# EAGLE design FF0881SA1 (EAGLE 9.6.2)
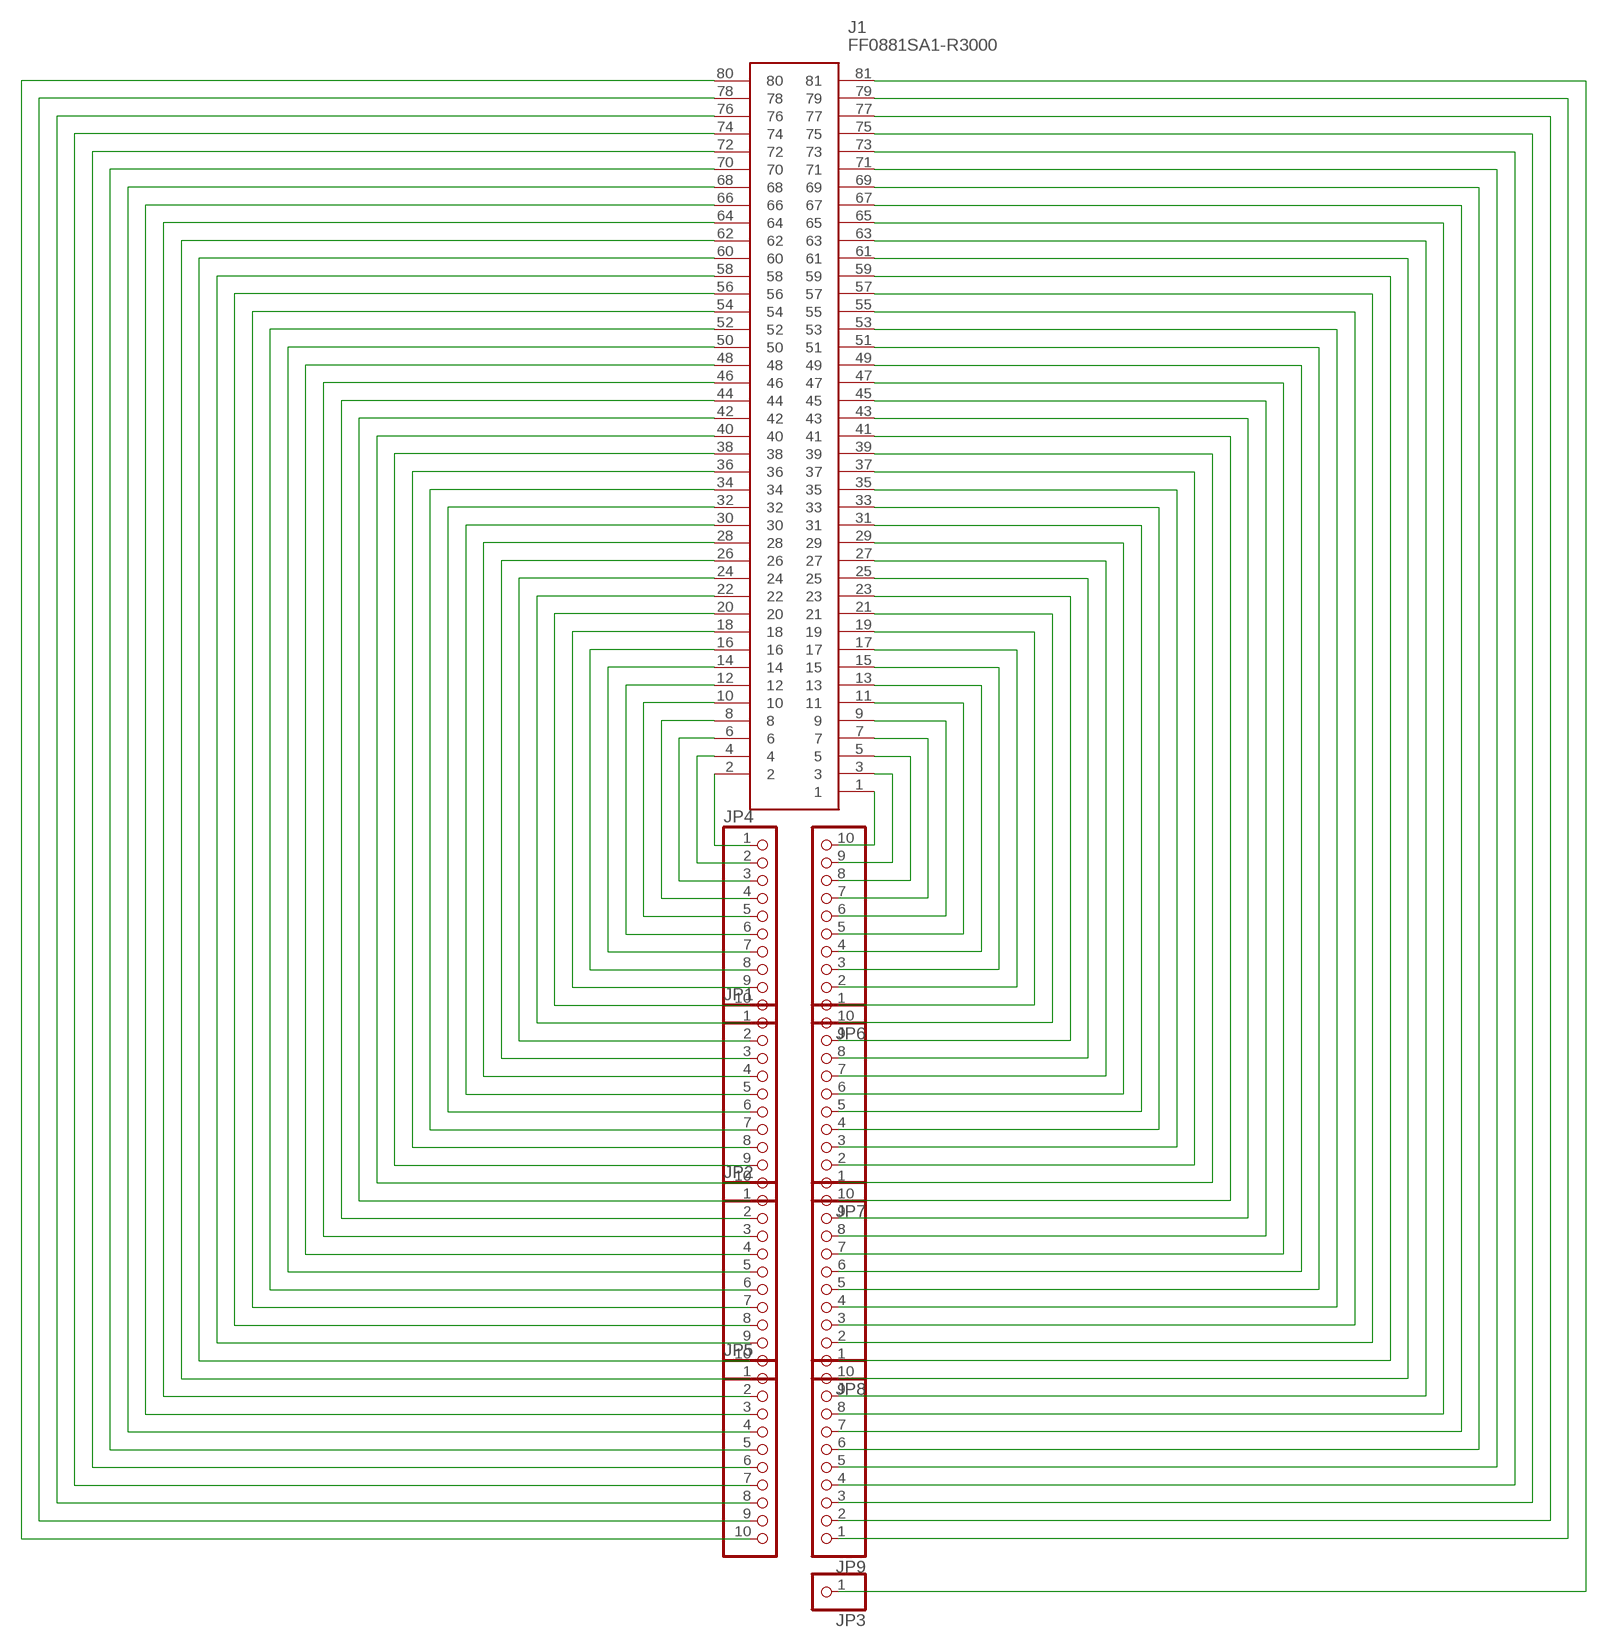
[diagram p0: schematic, sheet 1]

## Parts
J1  FF0881SA1-R3000  [FF0881SA1R3000]
JP1  PINHD-1X10  [1X10]
JP2  PINHD-1X10  [1X10]
JP3  PINHD-1X1  [1X01]
JP4  PINHD-1X10  [1X10]
JP5  PINHD-1X10  [1X10]
JP6  PINHD-1X10  [1X10]
JP7  PINHD-1X10  [1X10]
JP8  PINHD-1X10  [1X10]
JP9  PINHD-1X10  [1X10]

## Nets
N$1: J1.1 JP6.10
N$2: J1.3 JP6.9
N$3: J1.5 JP6.8
N$4: J1.7 JP6.7
N$5: J1.9 JP6.6
N$6: J1.11 JP6.5
N$7: J1.13 JP6.4
N$8: J1.15 JP6.3
N$9: J1.17 JP6.2
N$10: J1.19 JP6.1
N$11: J1.21 JP7.10
N$12: J1.23 JP7.9
N$13: J1.2 JP4.1
N$14: J1.4 JP4.2
N$15: J1.6 JP4.3
N$16: J1.8 JP4.4
N$17: J1.10 JP4.5
N$18: J1.12 JP4.6
N$19: J1.14 JP4.7
N$20: J1.16 JP4.8
N$21: J1.18 JP4.9
N$22: J1.20 JP4.10
N$23: J1.22 JP1.1
N$24: J1.24 JP1.2
N$25: J1.26 JP1.3
N$26: J1.28 JP1.4
N$27: J1.30 JP1.5
N$28: J1.32 JP1.6
N$29: J1.34 JP1.7
N$30: J1.36 JP1.8
N$31: J1.38 JP1.9
N$32: J1.40 JP1.10
N$33: J1.42 JP2.1
N$34: J1.44 JP2.2
N$35: J1.25 JP7.8
N$36: J1.27 JP7.7
N$37: J1.29 JP7.6
N$38: J1.31 JP7.5
N$39: J1.33 JP7.4
N$40: J1.35 JP7.3
N$41: J1.37 JP7.2
N$42: J1.39 JP7.1
N$43: J1.41 JP8.10
N$44: J1.43 JP8.9
N$45: J1.46 JP2.3
N$46: J1.48 JP2.4
N$47: J1.50 JP2.5
N$48: J1.52 JP2.6
N$49: J1.54 JP2.7
N$50: J1.56 JP2.8
N$51: J1.58 JP2.9
N$52: J1.60 JP2.10
N$53: J1.62 JP5.1
N$54: J1.64 JP5.2
N$55: J1.66 JP5.3
N$56: J1.68 JP5.4
N$57: J1.70 JP5.5
N$58: J1.72 JP5.6
N$59: J1.74 JP5.7
N$60: J1.76 JP5.8
N$61: J1.78 JP5.9
N$62: J1.80 JP5.10
N$63: J1.45 JP8.8
N$64: J1.47 JP8.7
N$65: J1.49 JP8.6
N$66: J1.51 JP8.5
N$67: J1.53 JP8.4
N$68: J1.55 JP8.3
N$69: J1.57 JP8.2
N$70: J1.59 JP8.1
N$71: J1.61 JP9.10
N$72: J1.63 JP9.9
N$73: J1.65 JP9.8
N$74: J1.67 JP9.7
N$75: J1.69 JP9.6
N$76: J1.71 JP9.5
N$77: J1.73 JP9.4
N$78: J1.75 JP9.3
N$79: J1.77 JP9.2
N$80: J1.79 JP9.1
N$81: J1.81 JP3.1

## Library data of the parts
J1 = SamacSys_Parts:FF0881SA1-R3000: FFC & FPC Connectors 81P 0.2MM FPC Source: Datasheet <https://datasheet.datasheetarchive.com/originals/distributors/Datasheets_SAMA/ec6021593b6498cdc50e1b69da769f77.pdf>; DESCRIPTION: FFC & FPC Connectors 81P 0.2MM FPC; HEIGHT: 1mm; MANUFACTURER_NAME: JAE Electronics; MANUFACTURER_PART_NUMBER: FF0881SA1-R3000; MOUSER_PART_NUMBER: 656-FF0881SA1-R3000; MOUSER_PRICE-STOCK: https://www.mouser.co.uk/ProductDetail/JAE-Electronics/FF0881SA1-R3000?qs=e3doH35UsB4mcpzu8vQ7Tw%3D%3D
JP1 JP2 JP4-JP9 = pinhead:PINHD-1X10: PIN HEADER
JP3 = pinhead:PINHD-1X1: PIN HEADER

## Board
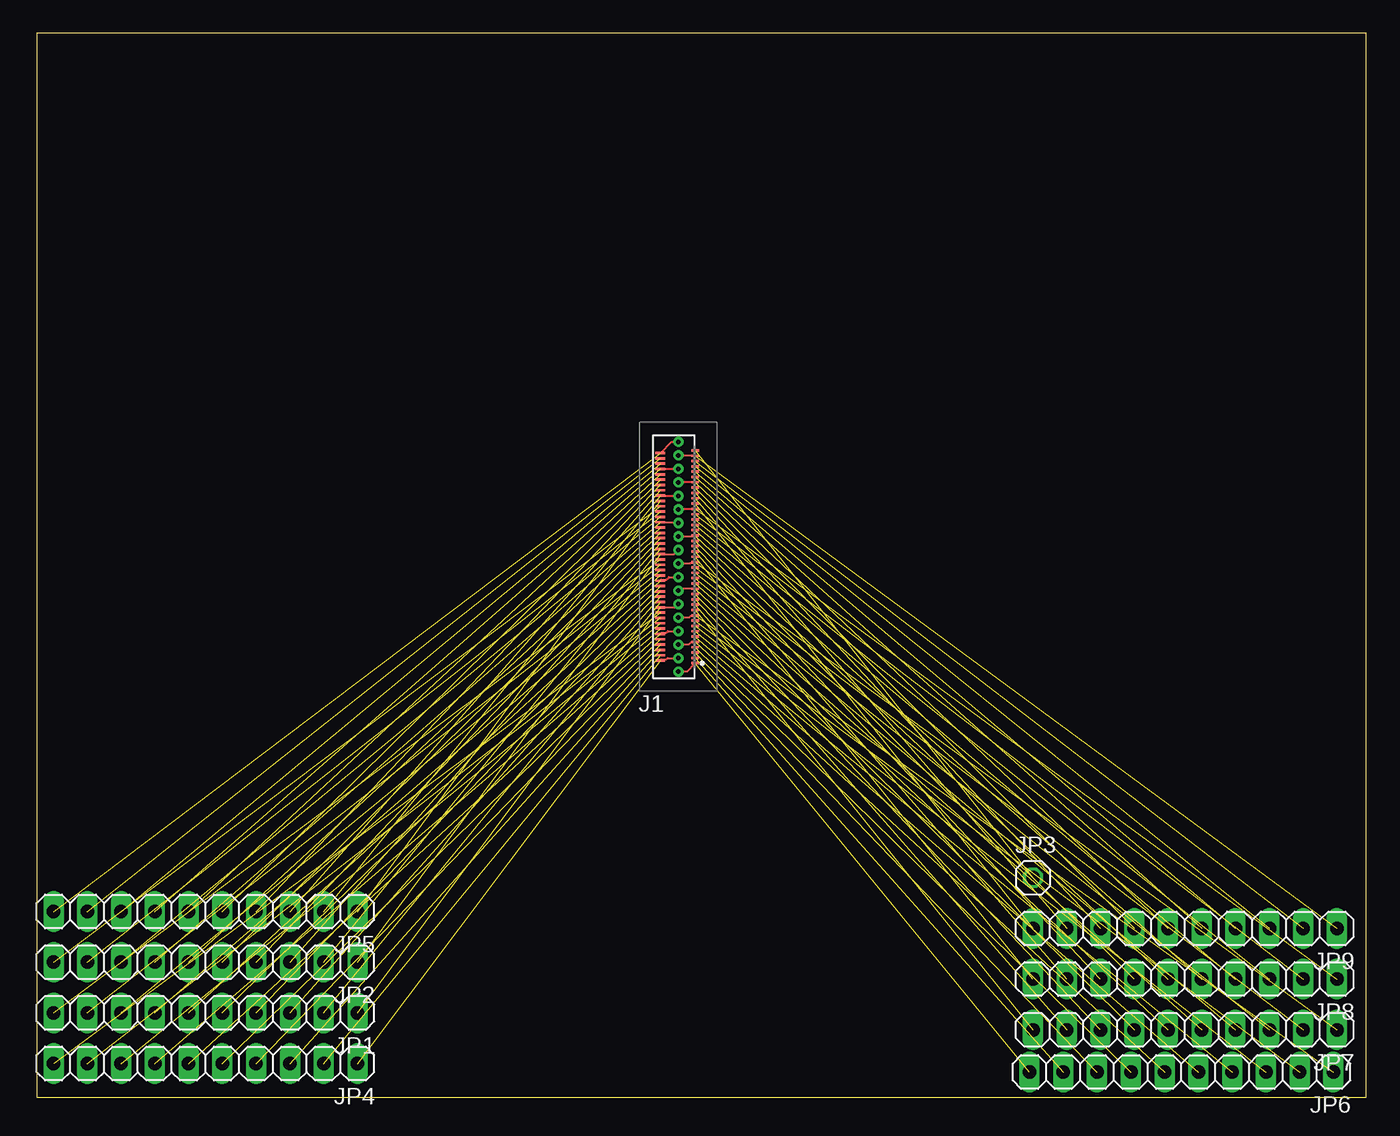
[diagram p1: board, top side]

Size 100 x 80 mm. Coordinates in mm from the lower left corner, seen from the top.
Outline: 0,0 100,0 100,80 0,80 0,0
Copper layers (1*16): Top 0.035mm / dielectric 1.5mm / Bottom 0.035mm
Design rules "default *": minimum track width 6mil, minimum drill 0.35mm, track to track 6mil, track to pad 6mil, pad to pad 6mil, via to via 6mil, smd to smd 6mil, copper to edge 40mil, drill to drill 6mil, minimum pad ring 10mil, minimum via ring 8mil, stop-mask expansion 4mil, vias tented up to drill 30mil, thermal gap 10mil

### Footprints (pad centres in the part's own frame; a part is rotated, then mirrored left to right if it is on the bottom)
FF0881SA1R3000 = smd 0.18 x 0.55: 1 8,1.274; 3 7.6,1.274; 5 7.2,1.274; 7 6.8,1.274; 9 6.4,1.274; 11 6,1.274; 13 5.6,1.274; 15 5.2,1.274; 17 4.8,1.274; 19 4.4,1.274; 21 4,1.274; 23 3.6,1.274; 25 3.2,1.274; 27 2.8,1.274; 29 2.4,1.274; 31 2,1.274; 33 1.6,1.274; 35 1.2,1.274; 37 0.8,1.274; 39 0.4,1.274; 41 0,1.274; 43 -0.4,1.274; 45 -0.8,1.274; 47 -1.2,1.274; 49 -1.6,1.274; 51 -2,1.274; 53 -2.4,1.274; 55 -2.8,1.274; 57 -3.2,1.274; 59 -3.6,1.274; 61 -4,1.274; 63 -4.4,1.274; 65 -4.8,1.274; 67 -5.2,1.274; 69 -5.6,1.274; 71 -6,1.274; 73 -6.4,1.274; 75 -6.8,1.274; 77 -7.2,1.274; 79 -7.6,1.274; 81 -8,1.274 | smd 0.18 x 0.7: 2 7.8,-1.351; 4 7.4,-1.351; 6 7,-1.351; 8 6.6,-1.351; 10 6.2,-1.351; 12 5.8,-1.351; 14 5.4,-1.351; 16 5,-1.351; 18 4.6,-1.351; 20 4.2,-1.351; 22 3.8,-1.351; 24 3.4,-1.351; 26 3,-1.351; 28 2.6,-1.351; 30 2.2,-1.351; 32 1.8,-1.351; 34 1.4,-1.351; 36 1,-1.351; 38 0.6,-1.351; 40 0.2,-1.351; 42 -0.2,-1.351; 44 -0.6,-1.351; 46 -1,-1.351; 48 -1.4,-1.351; 50 -1.8,-1.351; 52 -2.2,-1.351; 54 -2.6,-1.351; 56 -3,-1.351; 58 -3.4,-1.351; 60 -3.8,-1.351; 62 -4.2,-1.351; 64 -4.6,-1.351; 66 -5,-1.351; 68 -5.4,-1.351; 70 -5.8,-1.351; 72 -6.2,-1.351; 74 -6.6,-1.351; 76 -7,-1.351; 78 -7.4,-1.351; 80 -7.8,-1.351
1X10 = drill 1.016 long: 1 -11.43,0; 2 -8.89,0; 3 -6.35,0; 4 -3.81,0; 5 -1.27,0; 6 1.27,0; 7 3.81,0; 8 6.35,0; 9 8.89,0; 10 11.43,0
1X01 = drill 1.016 octagon: 1 0,0

### Placement (x,y rotation side)
J1  48.26,40.64 270 top
JP1  12.7,6.35 180 top
JP2  12.7,10.16 180 top
JP3  74.93,16.51 0 top
JP4  12.7,2.54 180 top
JP5  12.7,13.97 180 top
JP6  86.11,1.91 180 top
JP7  86.36,5.08 180 top
JP8  86.36,8.89 180 top
JP9  86.36,12.7 180 top

### Tracks (layer width: path | path; a pad name or v marks a point on that pad's centre or on a via)
N$1  (via drill 0.35)  (1 unrouted)
  Top 0.152: J1.1 48.9,32 v48.26,32
N$2  (1 unrouted)
N$3  (1 unrouted)
N$4  (1 unrouted)
N$5  (via drill 0.35)  (1 unrouted)
  Top 0.152: J1.9 49.45,34.16 49.16,34.16 49.04,34.04 v48.26,34.04
N$6  (1 unrouted)
N$7  (1 unrouted)
N$8  (1 unrouted)
N$9  (1 unrouted)
N$10  (via drill 0.35)  (1 unrouted)
  Top 0.152: J1.19 49.45,36.16 49.16,36.16 49.07,36.07 v48.26,36.07
N$11  (1 unrouted)
N$12  (1 unrouted)
N$13  (via drill 0.35)  (1 unrouted)
  Top 0.152: J1.2 46.99,32.92 47.35,32.92 47.45,33.02 v48.26,33.02
N$14  (1 unrouted)
N$15  (1 unrouted)
N$16  (1 unrouted)
N$17  (1 unrouted)
N$18  (via drill 0.35)  (1 unrouted)
  Top 0.152: J1.12 46.99,34.92 47.35,34.92 47.48,35.05 v48.26,35.05
N$19  (1 unrouted)
N$20  (1 unrouted)
N$21  (1 unrouted)
N$22  (1 unrouted)
N$23  (via drill 0.35)  (1 unrouted)
  Top 0.152: J1.22 48.02,36.84 v48.26,37.08
N$24  (1 unrouted)
N$25  (1 unrouted)
N$26  (1 unrouted)
N$27  (1 unrouted)
N$28  (via drill 0.35)  (1 unrouted)
  Top 0.152: J1.32 46.99,38.92 47.35,38.92 47.55,39.12 v48.26,39.12
N$29  (1 unrouted)
N$30  (1 unrouted)
N$31  (1 unrouted)
N$32  (1 unrouted)
N$33  (via drill 0.35)  (1 unrouted)
  Top 0.152: J1.42 47.95,40.84 v48.26,41.15
N$34  (1 unrouted)
N$35  (1 unrouted)
N$36  (1 unrouted)
N$37  (via drill 0.35)  (1 unrouted)
  Top 0.152: J1.29 48.4,38.24 v48.26,38.1
N$38  (1 unrouted)
N$39  (1 unrouted)
N$40  (1 unrouted)
N$41  (1 unrouted)
N$42  (via drill 0.35)  (1 unrouted)
  Top 0.152: J1.39 49.45,40.16 49.16,40.16 49.14,40.13 v48.26,40.13
N$43  (1 unrouted)
N$44  (1 unrouted)
N$45  (1 unrouted)
N$46  (1 unrouted)
N$47  (1 unrouted)
N$48  (1 unrouted)
N$49  (via drill 0.35)  (1 unrouted)
  Top 0.152: J1.54 48.2,43.24 v48.26,43.18
N$50  (1 unrouted)
N$51  (1 unrouted)
N$52  (1 unrouted)
N$53  (1 unrouted)
N$54  (via drill 0.35)  (1 unrouted)
  Top 0.152: J1.64 48.23,45.24 v48.26,45.21
N$55  (1 unrouted)
N$56  (1 unrouted)
N$57  (1 unrouted)
N$58  (1 unrouted)
N$59  (via drill 0.35)  (1 unrouted)
  Top 0.152: J1.74 v48.26,47.24
N$60  (1 unrouted)
N$61  (1 unrouted)
N$62  (via drill 0.35)  (1 unrouted)
  Top 0.152: J1.80 47.74,49.28 v48.26,49.28
N$63  (1 unrouted)
N$64  (1 unrouted)
N$65  (via drill 0.35)  (1 unrouted)
  Top 0.152: J1.49 49.46,42.16 v48.26,42.16
N$66  (1 unrouted)
N$67  (1 unrouted)
N$68  (1 unrouted)
N$69  (1 unrouted)
N$70  (via drill 0.35)  (1 unrouted)
  Top 0.152: J1.59 49.49,44.2 v48.26,44.2
N$71  (1 unrouted)
N$72  (1 unrouted)
N$73  (1 unrouted)
N$74  (1 unrouted)
N$75  (via drill 0.35)  (1 unrouted)
  Top 0.152: J1.69 49.52,46.23 v48.26,46.23
N$76  (1 unrouted)
N$77  (1 unrouted)
N$78  (1 unrouted)
N$79  (1 unrouted)
N$80  (via drill 0.35)  (1 unrouted)
  Top 0.152: J1.79 48.28,48.24 v48.26,48.26
N$81  (1 unrouted)